# EAGLE design WIMOS-motherboard (EAGLE 7.1.0)
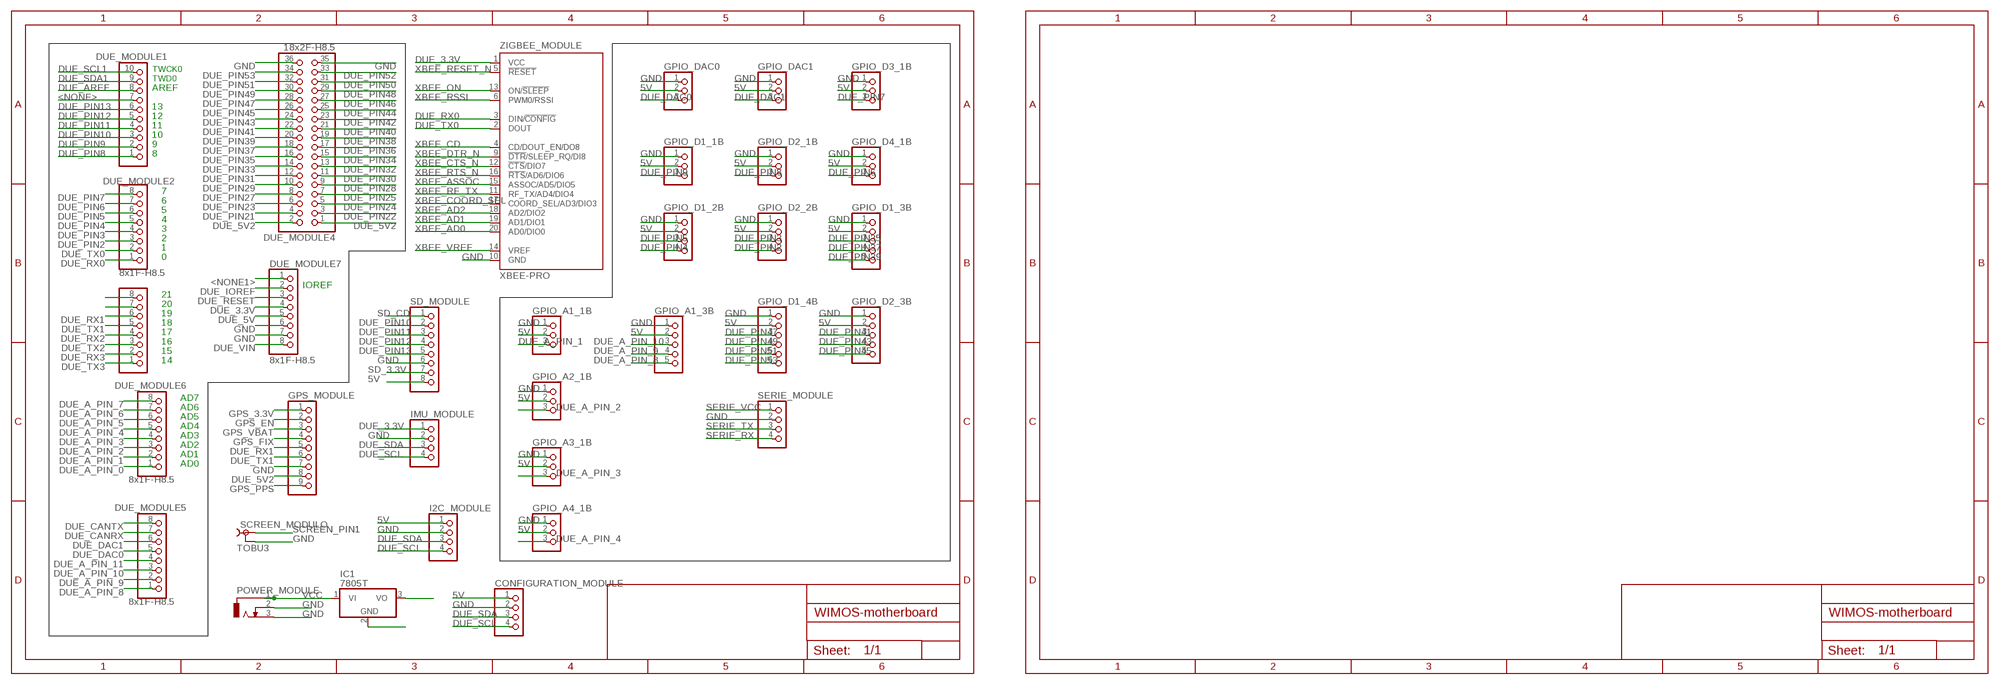
[diagram p0: schematic, sheet 1]

## Parts
CONFIGURATION_MODULE  PINHD-1X4  [1X04]
DUE_MODULE1  10x1F-H8.5  PINHD-1X10  [1X10]
DUE_MODULE2  8x1F-H8.5  PINHD-1X8  [1X08]
DUE_MODULE3  8x1F-H8.5  PINHD-1X8  [1X08]
DUE_MODULE4  18x2F-H8.5  PINHD-2X18  [2X18]
DUE_MODULE5  8x1F-H8.5  PINHD-1X8  [1X08]
DUE_MODULE6  8x1F-H8.5  PINHD-1X8  [1X08]
DUE_MODULE7  8x1F-H8.5  PINHD-1X8  [1X08]
GPIO_A1_1B  PINHD-1X3/90  [1X03/90]
GPIO_A1_3B  PINHD-1X5/90  [1X05/90]
GPIO_A2_1B  PINHD-1X3/90  [1X03/90]
GPIO_A3_1B  PINHD-1X3/90  [1X03/90]
GPIO_A4_1B  PINHD-1X3/90  [1X03/90]
GPIO_D1_1B  PINHD-1X3/90  [1X03/90]
GPIO_D1_2B  PINHD-1X4/90  [1X04/90]
GPIO_D1_3B  PINHD-1X5/90  [1X05/90]
GPIO_D1_4B  PINHD-1X6/90  [1X06/90]
GPIO_D2_1B  PINHD-1X3/90  [1X03/90]
GPIO_D2_2B  PINHD-1X4/90  [1X04/90]
GPIO_D2_3B  PINHD-1X5/90  [1X05/90]
GPIO_D3_1B  PINHD-1X3/90  [1X03/90]
GPIO_D4_1B  PINHD-1X3/90  [1X03/90]
GPIO_DAC0  PINHD-1X3/90  [1X03/90]
GPIO_DAC1  PINHD-1X3/90  [1X03/90]
GPS_MODULE  PINHD-1X9  [1X09]
I2C_MODULE  PINHD-1X4/90  [1X04/90]
IC1  7805T  [TO220H]
IMU_MODULE  PINHD-1X4  [1X04]
POWER_MODULE  DCJ0303  [DCJ0303]
SCREEN_MODULO  TOBU3  [TOBU3]
SD_MODULE  PINHD-1X8  [1X08]
SERIE_MODULE  PINHD-1X4/90  [1X04/90]
ZIGBEE_MODULE  XBEE-PRO  [XBEE-PRO]

## Nets
5V: CONFIGURATION_MODULE.1 GPIO_A1_1B.2 GPIO_A1_3B.2 GPIO_A2_1B.2 GPIO_A3_1B.2 GPIO_A4_1B.2 GPIO_D1_1B.2 GPIO_D1_2B.2 GPIO_D1_3B.2 GPIO_D1_4B.2 GPIO_D2_1B.2 GPIO_D2_2B.2 GPIO_D2_3B.2 GPIO_D3_1B.2 GPIO_D4_1B.2 GPIO_DAC0.2 GPIO_DAC1.2 I2C_MODULE.1 IC1.3(VO) SD_MODULE.8
<NONE1>: DUE_MODULE7.1
<NONE>: DUE_MODULE1.7
DUE_3.3V: DUE_MODULE7.4 IMU_MODULE.1 ZIGBEE_MODULE.1(VCC)
DUE_5V: DUE_MODULE7.5
DUE_5V2: DUE_MODULE4.1 DUE_MODULE4.2 GPS_MODULE.8
DUE_A_PIN_0: DUE_MODULE6.1
DUE_A_PIN_1: DUE_MODULE6.2 GPIO_A1_1B.3
DUE_A_PIN_2: DUE_MODULE6.3 GPIO_A2_1B.3
DUE_A_PIN_3: DUE_MODULE6.4 GPIO_A3_1B.3
DUE_A_PIN_4: DUE_MODULE6.5 GPIO_A4_1B.3
DUE_A_PIN_5: DUE_MODULE6.6
DUE_A_PIN_6: DUE_MODULE6.7
DUE_A_PIN_7: DUE_MODULE6.8
DUE_A_PIN_8: DUE_MODULE5.1 GPIO_A1_3B.5
DUE_A_PIN_9: DUE_MODULE5.2 GPIO_A1_3B.4
DUE_A_PIN_10: DUE_MODULE5.3 GPIO_A1_3B.3
DUE_A_PIN_11: DUE_MODULE5.4
DUE_AREF: DUE_MODULE1.8
DUE_CANRX: DUE_MODULE5.7
DUE_CANTX: DUE_MODULE5.8
DUE_DAC0: DUE_MODULE5.5 GPIO_DAC0.3
DUE_DAC1: DUE_MODULE5.6 GPIO_DAC1.3
DUE_IOREF: DUE_MODULE7.2
DUE_PIN2: DUE_MODULE2.3 GPIO_D2_2B.4
DUE_PIN3: DUE_MODULE2.4 GPIO_D2_2B.3
DUE_PIN4: DUE_MODULE2.5 GPIO_D1_2B.4
DUE_PIN5: DUE_MODULE2.6 GPIO_D1_2B.3
DUE_PIN6: DUE_MODULE2.7 GPIO_D4_1B.3
DUE_PIN7: DUE_MODULE2.8 GPIO_D3_1B.3
DUE_PIN8: DUE_MODULE1.1 GPIO_D2_1B.3
DUE_PIN9: DUE_MODULE1.2 GPIO_D1_1B.3
DUE_PIN10: DUE_MODULE1.3 SD_MODULE.2
DUE_PIN11: DUE_MODULE1.4 SD_MODULE.3
DUE_PIN12: DUE_MODULE1.5 SD_MODULE.4
DUE_PIN13: DUE_MODULE1.6 SD_MODULE.5
DUE_PIN21: DUE_MODULE4.4
DUE_PIN22: DUE_MODULE4.3
DUE_PIN23: DUE_MODULE4.6
DUE_PIN24: DUE_MODULE4.5
DUE_PIN25: DUE_MODULE4.7
DUE_PIN27: DUE_MODULE4.8
DUE_PIN28: DUE_MODULE4.9
DUE_PIN29: DUE_MODULE4.10
DUE_PIN30: DUE_MODULE4.11
DUE_PIN31: DUE_MODULE4.12
DUE_PIN32: DUE_MODULE4.13
DUE_PIN33: DUE_MODULE4.14
DUE_PIN34: DUE_MODULE4.15
DUE_PIN35: DUE_MODULE4.16 GPIO_D1_3B.3
DUE_PIN36: DUE_MODULE4.17
DUE_PIN37: DUE_MODULE4.18 GPIO_D1_3B.4
DUE_PIN38: DUE_MODULE4.19
DUE_PIN39: DUE_MODULE4.20 GPIO_D1_3B.5
DUE_PIN40: DUE_MODULE4.21
DUE_PIN41: DUE_MODULE4.22 GPIO_D2_3B.3
DUE_PIN42: DUE_MODULE4.23
DUE_PIN43: DUE_MODULE4.24 GPIO_D2_3B.4
DUE_PIN44: DUE_MODULE4.25
DUE_PIN45: DUE_MODULE4.26 GPIO_D2_3B.5
DUE_PIN46: DUE_MODULE4.27
DUE_PIN47: DUE_MODULE4.28 GPIO_D1_4B.3
DUE_PIN48: DUE_MODULE4.29
DUE_PIN49: DUE_MODULE4.30 GPIO_D1_4B.4
DUE_PIN50: DUE_MODULE4.31
DUE_PIN51: DUE_MODULE4.32 GPIO_D1_4B.5
DUE_PIN52: DUE_MODULE4.33
DUE_PIN53: DUE_MODULE4.34 GPIO_D1_4B.6
DUE_RESET: DUE_MODULE7.3
DUE_RX0: DUE_MODULE2.1 ZIGBEE_MODULE.3(DIN/!CONFIG)
DUE_RX1: DUE_MODULE3.6 GPS_MODULE.5
DUE_RX2: DUE_MODULE3.4
DUE_RX3: DUE_MODULE3.2
DUE_SCL: CONFIGURATION_MODULE.4 DUE_MODULE3.8 I2C_MODULE.4 IMU_MODULE.4
DUE_SCL1: DUE_MODULE1.10
DUE_SDA: CONFIGURATION_MODULE.3 DUE_MODULE3.7 I2C_MODULE.3 IMU_MODULE.3
DUE_SDA1: DUE_MODULE1.9
DUE_TX0: DUE_MODULE2.2 ZIGBEE_MODULE.2(DOUT)
DUE_TX1: DUE_MODULE3.5 GPS_MODULE.6
DUE_TX2: DUE_MODULE3.3
DUE_TX3: DUE_MODULE3.1
DUE_VIN: DUE_MODULE7.8
GND [gnd]: CONFIGURATION_MODULE.2 DUE_MODULE4.35 DUE_MODULE4.36 DUE_MODULE7.6 DUE_MODULE7.7 GPIO_A1_1B.1 GPIO_A1_3B.1 GPIO_A2_1B.1 GPIO_A3_1B.1 GPIO_A4_1B.1 GPIO_D1_1B.1 GPIO_D1_2B.1 GPIO_D1_3B.1 GPIO_D1_4B.1 GPIO_D2_1B.1 GPIO_D2_2B.1 GPIO_D2_3B.1 GPIO_D3_1B.1 GPIO_D4_1B.1 GPIO_DAC0.1 GPIO_DAC1.1 GPS_MODULE.7 I2C_MODULE.2 IC1.2(GND) IMU_MODULE.2 POWER_MODULE.2 POWER_MODULE.3 SCREEN_MODULO.2 SCREEN_MODULO.2@1 SCREEN_MODULO.2@2 SD_MODULE.6 SERIE_MODULE.2 ZIGBEE_MODULE.10(GND)
GPS_3.3V: GPS_MODULE.1
GPS_EN: GPS_MODULE.2
GPS_FIX: GPS_MODULE.4
GPS_PPS: GPS_MODULE.9
GPS_VBAT: GPS_MODULE.3
SCREEN_PIN1: SCREEN_MODULO.1
SD_3.3V: SD_MODULE.7
SD_CD: SD_MODULE.1
SERIE_RX: SERIE_MODULE.4
SERIE_TX: SERIE_MODULE.3
SERIE_VCC: SERIE_MODULE.1
VCC: IC1.1(VI) POWER_MODULE.1
XBEE_AD0: ZIGBEE_MODULE.20(AD0/DIO0)
XBEE_AD1: ZIGBEE_MODULE.19(AD1/DIO1)
XBEE_AD2: ZIGBEE_MODULE.18(AD2/DIO2)
XBEE_ASSOC: ZIGBEE_MODULE.15(ASSOC/AD5/DIO5)
XBEE_CD: ZIGBEE_MODULE.4(CD/DOUT_EN/DO8)
XBEE_COORD_SEL: ZIGBEE_MODULE.17(COORD_SEL/AD3/DIO3)
XBEE_CTS_N: ZIGBEE_MODULE.12(!CTS!/DIO7)
XBEE_DTR_N: ZIGBEE_MODULE.9(!DTR!/SLEEP_RQ/DI8)
XBEE_ON: ZIGBEE_MODULE.13(ON/!SLEEP)
XBEE_RESET_N: ZIGBEE_MODULE.5(!RESET)
XBEE_RF_TX: ZIGBEE_MODULE.11(RF_TX/AD4/DIO4)
XBEE_RSSI: ZIGBEE_MODULE.6(PWM0/RSSI)
XBEE_RTS_N: ZIGBEE_MODULE.16(!RTS!/AD6/DIO6)
XBEE_VREF: ZIGBEE_MODULE.14(VREF)

## Notes on the sheet
- TWCK0
- TWD0
- AREF
- 13
- 12
- 11
- 10
- 9
- 8
- 7
- 6
- 5
- 4
- 3
- 2
- 1
- 0
- IOREF
- 21
- 20
- 19
- 18
- 17
- 16
- 15
- 14
- AD7
- AD6
- AD5
- AD4
- AD3
- AD2
- AD1
- AD0

## Library data of the parts
CONFIGURATION_MODULE GPIO_D1_2B GPIO_D2_2B I2C_MODULE IMU_MODULE SERIE_MODULE = pinhead:PINHD-1X4: PIN HEADER
DUE_MODULE1 = SmartPrj:PINHD-1X10: PIN HEADER
DUE_MODULE2 DUE_MODULE3 DUE_MODULE5-DUE_MODULE7 = SmartPrj:PINHD-1X8: PIN HEADER
DUE_MODULE4 = SmartPrj:PINHD-2X18: PIN HEADER
GPIO_A1_1B GPIO_A2_1B GPIO_A3_1B GPIO_A4_1B GPIO_D1_1B GPIO_D2_1B GPIO_D3_1B GPIO_D4_1B GPIO_DAC0 GPIO_DAC1 = pinhead:PINHD-1X3: PIN HEADER
GPIO_A1_3B GPIO_D1_3B GPIO_D2_3B = pinhead:PINHD-1X5: PIN HEADER
GPIO_D1_4B = pinhead:PINHD-1X6: PIN HEADER
GPS_MODULE = pinhead:PINHD-1X9: PIN HEADER
IC1 = linear:78*: Positive VOLTAGE REGULATOR Source: http://cache.national.com/ds/LM/LM78L05.pdf http://www.fairchildsemi.com/ds/LM/LM7805.pdf
POWER_MODULE = con-jack:DCJ0303: DC POWER JACK Source: DCJ0303.pdf; OC_FARNELL: unknown; OC_NEWARK: unknown
SCREEN_MODULO = con-hirschmann:TOBU3: Female Cinch CONNECTOR ( RCA Jack ); MF: FARNELL; MPN: TOBU 3; OC_FARNELL: 592791; OC_NEWARK: 06WX5914
SD_MODULE = pinhead:PINHD-1X8: PIN HEADER
ZIGBEE_MODULE = maxstream:XBEE: XBee (TM) /XBee-PRO(TM) OEM RF Modules Source: MaxStream, Inc. xbee_productmanual.pdf; MPN: XBP24-AWI-001; OC_FARNELL: 1337916; OC_NEWARK: 42M2667

## Module INPUT
Ports: 

### Library data of the parts

## Net classes
0 default: width 0.203 mm, drill 0.406 mm, clearance 0.203 mm
1 USB: width 0.203 mm, drill 0.406 mm, clearance 0.203 mm
2 gnd: width 0.203 mm, drill 0.406 mm, clearance 0.203 mm
3 usbvcc: width 0.203 mm, drill 0.406 mm, clearance 0.203 mm
4 USBpair: width 0.254 mm, drill 0.406 mm, clearance 0.61 mm

## Board
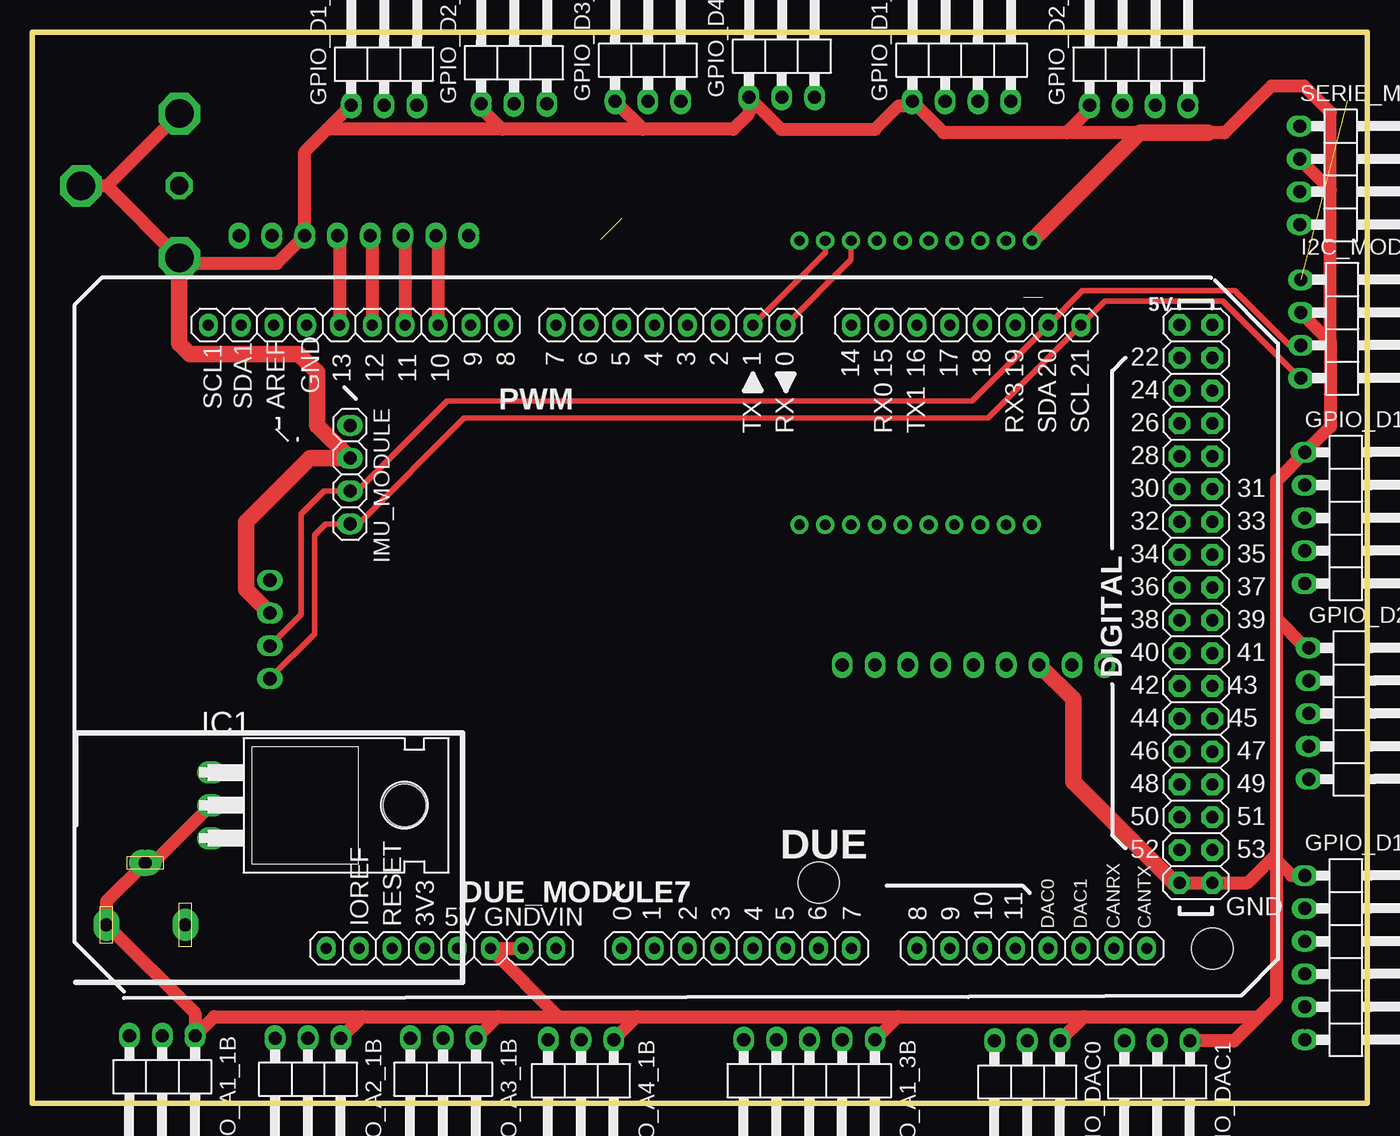
[diagram p1: board, top side]
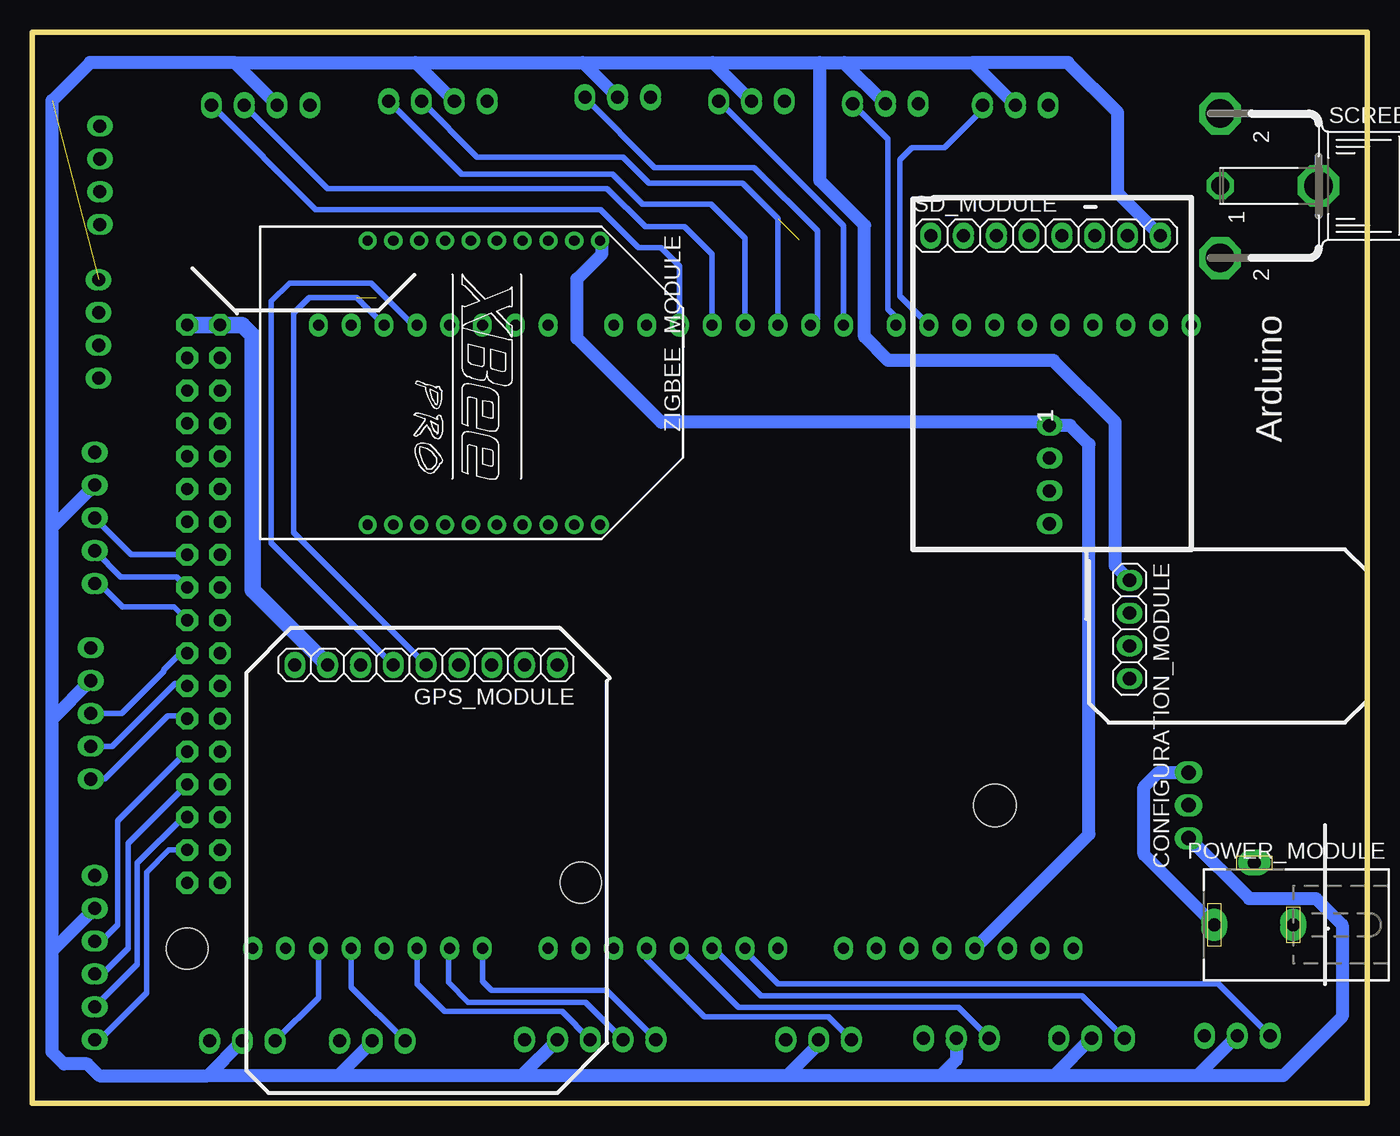
[diagram p2: board, bottom side, seen from below]

Size 103.33 x 82.91 mm. Coordinates in mm from the lower left corner, seen from the top.
Outline: 0,82.91 0,0 103.33,0 103.33,82.91 0,82.91
Copper layers (1*16): Top 0.035mm / dielectric 1.6mm / Bottom 0.035mm
Design rules "default *": minimum track width 8mil, minimum drill 16mil, track to track 8mil, track to pad 8mil, pad to pad 8mil, via to via 8mil, smd to smd 6mil, copper to edge 20mil, drill to drill 12mil, minimum pad ring 12mil, minimum via ring 8mil, stop-mask expansion 2mil, vias tented up to drill 25mil, thermal gap 8mil
Holes 3.2 mm at 91.34,11.99 60.86,17.07
tRestrict: area 58.3,14.5 to 63.4,19.6; area 88.8,9.4 to 93.9,14.5
bRestrict: area 58.3,14.5 to 63.4,19.6; area 88.8,9.4 to 93.9,14.5

### Footprints (pad centres in the part's own frame; a part is rotated, then mirrored left to right if it is on the bottom)
1X04 = drill 1.016 long: 1 -3.81,0; 2 -1.27,0; 3 1.27,0; 4 3.81,0
1X10 = drill 0.85 pad 1.422 long: 1 -11.43,0; 2 -8.89,0; 3 -6.35,0; 4 -3.81,0; 5 -1.27,0; 6 1.27,0; 7 3.81,0; 8 6.35,0; 9 8.89,0; 10 11.43,0
1X08 = drill 0.85 pad 1.422 long: 1 -8.89,0; 2 -6.35,0; 3 -3.81,0; 4 -1.27,0; 5 1.27,0; 6 3.81,0; 7 6.35,0; 8 8.89,0
2X18 = drill 0.95 pad 1.676 octagon: 1 -21.59,-1.27; 2 -21.59,1.27; 3 -19.05,-1.27; 4 -19.05,1.27; 5 -16.51,-1.27; 6 -16.51,1.27; 7 -13.97,-1.27; 8 -13.97,1.27; 9 -11.43,-1.27; 10 -11.43,1.27; 11 -8.89,-1.27; 12 -8.89,1.27; 13 -6.35,-1.27; 14 -6.35,1.27; 15 -3.81,-1.27; 16 -3.81,1.27; 17 -1.27,-1.27; 18 -1.27,1.27; 19 1.27,-1.27; 20 1.27,1.27; 21 3.81,-1.27; 22 3.81,1.27; 23 6.35,-1.27; 24 6.35,1.27; 25 8.89,-1.27; 26 8.89,1.27; 27 11.43,-1.27; 28 11.43,1.27; 29 13.97,-1.27; 30 13.97,1.27; 31 16.51,-1.27; 32 16.51,1.27; 33 19.05,-1.27; 34 19.05,1.27; 35 21.59,-1.27; 36 21.59,1.27
1X03/90 = drill 1.016 long: 1 -2.54,-3.81; 2 0,-3.81; 3 2.54,-3.81
1X05/90 = drill 1.016 long: 1 -5.08,-3.81; 2 -2.54,-3.81; 3 0,-3.81; 4 2.54,-3.81; 5 5.08,-3.81
1X04/90 = drill 1.016 long: 1 -3.81,-3.81; 2 -1.27,-3.81; 3 1.27,-3.81; 4 3.81,-3.81
1X06/90 = drill 1.016 long: 1 -6.35,-3.81; 2 -3.81,-3.81; 3 -1.27,-3.81; 4 1.27,-3.81; 5 3.81,-3.81; 6 6.35,-3.81
1X09 = drill 1.016 long: 1 -10.16,0; 2 -7.62,0; 3 -5.08,0; 4 -2.54,0; 5 0,0; 6 2.54,0; 7 5.08,0; 8 7.62,0; 9 10.16,0
TO220H = drill 1.118 long: 1 -2.54,-10.16; 2 0,-10.16; 3 2.54,-10.16 | hole 3.302: 0,4.826
DCJ0303 = drill 1 pad 2 long: 1 0,3.1; 2 4.8,0; 3 0,-3
TOBU3 = drill 1.397 octagon: 1 0,-2.54 | drill 2.21 octagon: 2 5.588,-2.54; 2@1 -5.588,-2.54; 2@2 0,5.08
1X08' = drill 1.016 long: 1 -8.89,0; 2 -6.35,0; 3 -3.81,0; 4 -1.27,0; 5 1.27,0; 6 3.81,0; 7 6.35,0; 8 8.89,0
XBEE-PRO = drill 0.8 pad 1.27: 1 -11,9; 2 -11,7; 3 -11,5; 4 -11,3; 5 -11,1; 6 -11,-1; 7 -11,-3; 8 -11,-5; 9 -11,-7; 10 -11,-9; 11 11,-9; 12 11,-7; 13 11,-5; 14 11,-3; 15 11,-1; 16 11,1; 17 11,3; 18 11,5; 19 11,7; 20 11,9

### Placement (x,y rotation side)
CONFIGURATION_MODULE  18.39,36.68 270 bottom
DUE_MODULE1  25.04,60.25 180 top
DUE_MODULE2  49.43,60.25 180 top
DUE_MODULE3  72.29,60.25 0 top
DUE_MODULE4  90.07,38.66 270 top
DUE_MODULE5  77.37,11.99 0 top
DUE_MODULE6  54.51,11.99 0 top
DUE_MODULE7  31.65,11.99 0 top
GPIO_A1_1B  10.06,1.42 180 top
GPIO_A1_3B  60.15,1.12 180 top
GPIO_A2_1B  21.34,1.22 180 top
GPIO_A3_1B  31.8,1.22 180 top
GPIO_A4_1B  42.47,1.12 180 top
GPIO_D1_1B  27.23,81.08 0 top
GPIO_D1_2B  71.93,81.38 0 top
GPIO_D1_3B  102.31,45.31 270 top
GPIO_D1_4B  102.31,11.28 270 top
GPIO_D2_1B  37.29,81.18 0 top
GPIO_D2_2B  85.65,81.08 0 top
GPIO_D2_3B  102.62,30.18 270 top
GPIO_D3_1B  47.65,81.38 0 top
GPIO_D4_1B  58.01,81.69 0 top
GPIO_DAC0  77.01,1.02 180 top
GPIO_DAC1  87.07,1.02 180 top
GPS_MODULE  72.85,33.93 180 bottom
I2C_MODULE  102.01,59.94 270 top
IC1  23.98,23.06 270 top
IMU_MODULE  24.59,48.67 270 top
POWER_MODULE  8.74,13.82 90 bottom
SCREEN_MODULO  8.84,71.02 270 bottom
SD_MODULE  [1X08']  24.89,67.16 0 bottom
SERIE_MODULE  101.9,71.83 270 top
ZIGBEE_MODULE  68.38,55.78 270 bottom

### Tracks (layer width: path | path; a pad name or v marks a point on that pad's centre or on a via)
5V  (1 unrouted)
  Bottom 1.016: GPIO_A2_1B.2 24.23,2.13 | 24.23,2.13 33.02,2.13 | 33.02,2.13 44.91,2.13 | 44.91,2.13 65.48,2.13 | 65.48,2.13 79.65,2.13 | 79.65,2.13 89.76,2.13 | 101.8,11.79 101.8,3.96 100.89,3.05 99.06,3.05 98.15,2.13 89.76,2.13 | 101.8,11.79 101.8,29.72 | 101.8,29.72 101.8,44.55 | 101.8,44.55 101.8,77.62 98.86,80.57 87.68,80.57 | 87.68,80.57 73.66,80.57 | 73.66,80.57 60.71,80.57 | 60.71,80.57 50.65,80.57 | 50.65,80.57 42.37,80.57 | 42.37,80.57 40.49,80.57 | 40.49,80.57 30.53,80.57 | GPIO_D1_1B.2 30.53,80.57 | GPIO_D2_1B.2 40.49,80.57 | GPIO_D3_1B.2 50.65,80.57 | GPIO_D4_1B.2 60.71,80.57 | GPIO_D1_2B.2 73.66,80.57 | GPIO_D2_2B.2 87.68,80.57 | GPIO_D1_3B.2 101.8,44.55 | GPIO_D2_3B.2 101.8,29.72 | GPIO_D1_4B.2 101.8,11.79 | 89.76,2.13 GPIO_DAC1.2 | GPIO_DAC0.2 77.01,4.77 79.65,2.13 | GPIO_A4_1B.2 42.47,4.57 44.91,2.13 | GPIO_A3_1B.2 31.8,3.35 33.02,2.13 | GPIO_A1_1B.2 13.16,2.13 | 13.16,2.13 24.23,2.13 | GPIO_A1_3B.2 65.48,2.13 | SD_MODULE.8 19.3,70.46 19.3,76.71 23.16,80.57 30.53,80.57 | IC1.3 9.14,15.85 3.96,15.85 1.93,13.82 1.93,6.71 6.5,2.13 13.16,2.13 | CONFIGURATION_MODULE.1 19.51,41.6 19.51,52.73 24.28,57.51 37.08,57.51 38.91,59.33 38.91,67.97 42.37,71.42 42.37,80.57
DUE_3.3V
  Bottom 1.016: DUE_MODULE7.4 21.54,20.83 21.54,51 23.01,52.48 IMU_MODULE.1 24.84,52.73 54.66,52.73 61.16,59.23 61.16,63.8 59.23,65.73 59.23,66.63 ZIGBEE_MODULE.1
DUE_5V2
  Bottom 1.27: GPS_MODULE.8 86.26,39.73 86.26,59.44 87.07,60.25 DUE_MODULE4.1 DUE_MODULE4.2
DUE_A_PIN_1
  Bottom 0.406: GPIO_A1_1B.3 11.53,9.25 45.62,9.25 48.16,11.79 DUE_MODULE6.2
DUE_A_PIN_2
  Bottom 0.406: GPIO_A2_1B.3 22.1,8.33 46.94,8.33 50.6,11.99 DUE_MODULE6.3
DUE_A_PIN_3
  Bottom 0.406: GPIO_A3_1B.3 31.65,7.42 48.67,7.42 DUE_MODULE6.4
DUE_A_PIN_4
  Bottom 0.406: GPIO_A4_1B.3 41.71,6.71 51.31,6.71 55.78,11.18 DUE_MODULE6.5
DUE_A_PIN_8
  Bottom 0.406: GPIO_A1_3B.5 58.88,8.74 67.77,8.74 68.48,9.45 DUE_MODULE5.1
DUE_A_PIN_9
  Bottom 0.406: GPIO_A1_3B.4 60.5,7.82 69.6,7.82 71.12,9.35 71.12,11.48 71.02,11.58 DUE_MODULE5.2
DUE_A_PIN_10
  Bottom 0.406: GPIO_A1_3B.3 62.33,7.11 71.42,7.11 73.56,9.25 DUE_MODULE5.3
DUE_DAC0
  Bottom 0.406: GPIO_DAC0.3 78.64,8.99 DUE_MODULE5.5
DUE_DAC1
  Bottom 0.406: GPIO_DAC1.3 81.18,8.18 DUE_MODULE5.6
DUE_PIN2
  Bottom 0.406: DUE_MODULE2.3 53.24,64.82 54.66,66.24 56.39,66.24 59.33,69.19 81.38,69.19 GPIO_D2_2B.4
DUE_PIN3
  Bottom 0.406: DUE_MODULE2.4 50.7,65.73 52.83,67.87 55.88,67.87 58.83,70.81 80.47,70.81 GPIO_D2_2B.3
DUE_PIN4
  Bottom 0.406: DUE_MODULE2.5 48.16,66.95 50.8,69.6 56.08,69.6 58.42,71.93 70.1,71.93 GPIO_D1_2B.4
DUE_PIN5  (1 unrouted)
  Bottom 0.406: GPIO_D1_2B.3 68.88,73.25 57.61,73.25 55.58,71.22 48.36,71.22 45.62,68.48 DUE_MODULE2.6
DUE_PIN6
  Bottom 0.406: GPIO_D4_1B.3 60.55,77.83 55.17,72.44 47.45,72.44 42.57,67.56 42.57,60.76 DUE_MODULE2.7
DUE_PIN7
  Bottom 0.406: GPIO_D3_1B.3 40.54,67.92 DUE_MODULE2.8
DUE_PIN8
  Bottom 0.406: GPIO_D2_1B.3 37.08,74.62 37.08,61.47 36.47,60.86 DUE_MODULE1.1
DUE_PIN9
  Bottom 0.406: GPIO_D1_1B.3 29.77,76.91 32.72,73.96 35.26,73.96 36.17,73.05 36.17,62.48 DUE_MODULE1.2
DUE_PIN10
  Top 1.016: SD_MODULE.2 31.39,67 DUE_MODULE1.3
DUE_PIN11
  Top 1.016: SD_MODULE.3 28.85,67 DUE_MODULE1.4
DUE_PIN12
  Top 1.016: SD_MODULE.4 26.31,67 DUE_MODULE1.5
DUE_PIN13
  Top 1.016: SD_MODULE.5 23.77,67 DUE_MODULE1.6
DUE_PIN35
  Bottom 0.406: GPIO_D1_3B.3 95.66,42.47 DUE_MODULE4.16
DUE_PIN37
  Bottom 0.406: GPIO_D1_3B.4 96.47,40.74 92.15,40.74 DUE_MODULE4.18
DUE_PIN39
  Bottom 0.406: GPIO_D1_3B.5 98.15,40.23 96.32,38.4 92.35,38.4 DUE_MODULE4.20
DUE_PIN41
  Bottom 0.406: GPIO_D2_3B.3 96.42,30.17 93.17,33.43 93.17,33.53 91.95,34.75 91.44,34.75 DUE_MODULE4.22
DUE_PIN43
  Bottom 0.406: GPIO_D2_3B.4 97.13,27.63 92.25,32.51 91.54,32.51 DUE_MODULE4.24
DUE_PIN45
  Bottom 0.406: GPIO_D2_3B.5 97.74,25.09 92.86,29.97 91.54,29.97 DUE_MODULE4.26
DUE_PIN47
  Bottom 0.406: GPIO_D1_4B.3 97.99,12.55 96.72,13.82 96.72,21.84 DUE_MODULE4.28
DUE_PIN49
  Bottom 0.406: DUE_MODULE4.30 95.91,20.12 95.91,11.99 97.89,10.01 GPIO_D1_4B.4
DUE_PIN51
  Bottom 0.406: GPIO_D1_4B.5 95.2,10.77 95.2,18.59 91.64,22.15 DUE_MODULE4.32
DUE_PIN53
  Bottom 0.406: GPIO_D1_4B.6 98.5,4.83 98.35,4.67 94.49,8.53 94.49,17.88 92.76,19.61 DUE_MODULE4.34
DUE_RX0
  Top 0.406: ZIGBEE_MODULE.3 63.38,65.31 DUE_MODULE2.1
DUE_RX1  (1 unrouted)
  Bottom 0.406: GPS_MODULE.5 83.11,44.2 83.11,61.16 81.89,62.38 78.23,62.38 DUE_MODULE3.6
DUE_SCL
  Top 0.406: CONFIGURATION_MODULE.4 21.84,36.32 21.84,43.99 22.71,44.86 IMU_MODULE.4 25.25,44.86 33.43,53.03 73.96,53.03 DUE_MODULE3.8 83.01,62.08 92.15,62.08 98.09,56.13 I2C_MODULE.4
DUE_SDA
  Top 0.406: CONFIGURATION_MODULE.3 20.83,37.85 20.83,45.62 22.61,47.4 IMU_MODULE.3 25.15,47.4 32.11,54.36 72.75,54.36 DUE_MODULE3.7 81.28,62.89 93.07,62.89 97.28,58.67 I2C_MODULE.3
DUE_TX0
  Top 0.406: ZIGBEE_MODULE.2 61.38,65.85 DUE_MODULE2.2
DUE_TX1
  Bottom 0.406: GPS_MODULE.6 84.84,43.38 84.84,62.08 83.41,63.5 77.11,63.5 73.86,60.25 DUE_MODULE3.5
GND
  Top 0.61: 38.1,11.38 38.51,11.79 38.2,11.79 DUE_MODULE7.7 38.3,12.29
  Top 1.016: DUE_MODULE7.7 DUE_MODULE7.6 40.74,6.71 | SCREEN_MODULO.2@1 5.79,71.02 | SCREEN_MODULO.2@2 5.79,71.02 | 5.79,71.02 SCREEN_MODULO.2 11.79,65.02 18.95,65.02 SD_MODULE.6 21.08,73.66 22.81,75.39 | 22.81,75.39 GPIO_D1_1B.1 | 90.32,75.13 80.06,75.13 | 80.06,75.13 70.56,75.13 68.48,77.22 | 68.48,77.22 GPIO_D1_2B.1 | GPIO_D2_2B.1 81.84,76.91 80.06,75.13 | 47.29,75.39 36.37,75.39 | 36.37,75.39 22.81,75.39 | 47.29,75.39 54.25,75.39 55.47,76.61 GPIO_D4_1B.1 57.96,75.39 65.23,75.39 67.06,77.22 68.48,77.22 | 47.29,75.39 GPIO_D3_1B.1 | GPIO_D2_1B.1 34.75,77.01 36.37,75.39 | GPIO_D1_4B.1 97.49,17.63 96.32,18.8 | 96.32,18.8 96.32,19.3 | 96.32,19.3 96.32,37.49 | GPIO_D2_3B.1 98.55,35.25 96.32,37.49 | GPIO_D1_3B.1 97.84,50.39 | 96.32,19.3 94.08,17.07 DUE_MODULE4.36 DUE_MODULE4.35 | 25.55,6.71 14.07,6.71 GPIO_A1_1B.1 12.6,6.96 POWER_MODULE.3 5.74,15.62 POWER_MODULE.2 9.37,18.62 IC1.2 | 25.55,6.71 36.02,6.71 | 40.74,6.71 46.79,6.71 | 46.79,6.71 67.01,6.71 | 67.01,6.71 81.43,6.71 | 81.43,6.71 94.89,6.71 | 94.89,6.71 96.32,8.13 96.32,18.8 | GPIO_A3_1B.1 36.02,6.71 | 36.02,6.71 40.74,6.71 | GPIO_A1_3B.1 67.01,6.71 | 94.89,6.71 93.01,4.83 GPIO_DAC1.1 | GPIO_DAC0.1 81.43,6.71 | GPIO_A2_1B.1 25.55,6.71 | GPIO_A4_1B.1 46.79,6.71 | 96.32,37.49 96.32,48.21 GPIO_D1_3B.1 | GPIO_D1_3B.1 100.48,52.37 100.48,58.93 | 100.48,58.93 100.48,70.71 | 100.48,70.71 100.48,76.71 98.45,78.74 95.91,78.74 92.3,75.13 91.03,75.13 | SERIE_MODULE.2 100.48,70.71 | I2C_MODULE.2 100.48,58.93
  Top 1.27: GPS_MODULE.7 80.57,31.29 80.57,24.89 88.39,17.07 DUE_MODULE4.35 | SCREEN_MODULO.2 11.38,58.83 12.19,58.01 20.62,58.01 22.05,56.59 22.05,52.48 IMU_MODULE.2 21.49,49.94 16.56,45.01 16.56,39.78 CONFIGURATION_MODULE.2 | ZIGBEE_MODULE.10 85.73,75.13 90.32,75.13 91.03,75.13
VCC
  Bottom 1.016: POWER_MODULE.1 17.27,19.25 17.27,24.49 16.15,25.6 IC1.1

### Text on the board
tPlace: 9 | 8 | 7 | 6 | 5 | 4 | 3 | 2 | 1 | 0 | 22 | 14 | 15 | 16 | 17 | 18 | 19 | 20 | 21 | 13 | 12 | 11 | 10 | 24 | 26 | 28 | 30 | 31 | 32 | 33 | 34 | 35 | 36 | 37 | 38 | 39 | 40 | 41 | 42 | 43 | 44 | 45 | 46 | 47 | 48 | 49 | 50 | 51 | 52 | 53 | 0 | 1 | 2 | 3 | 4 | 5 | 6 | 7 | 8 | 9 | 10 | 11 | DAC0 | DAC1 | CANRX | CANTX
tNames: 5V | GND | SCL1 | SDA1 | AREF | PWM | TX | RX | RX0 | TX1 | RX3 | SDA | SCL | DIGITAL | DUE | GND | IOREF | RESET | 3V3 | 5V | GND | VIN
bNames: 1 | Arduino